# Altium project DCSource.PrjPcb
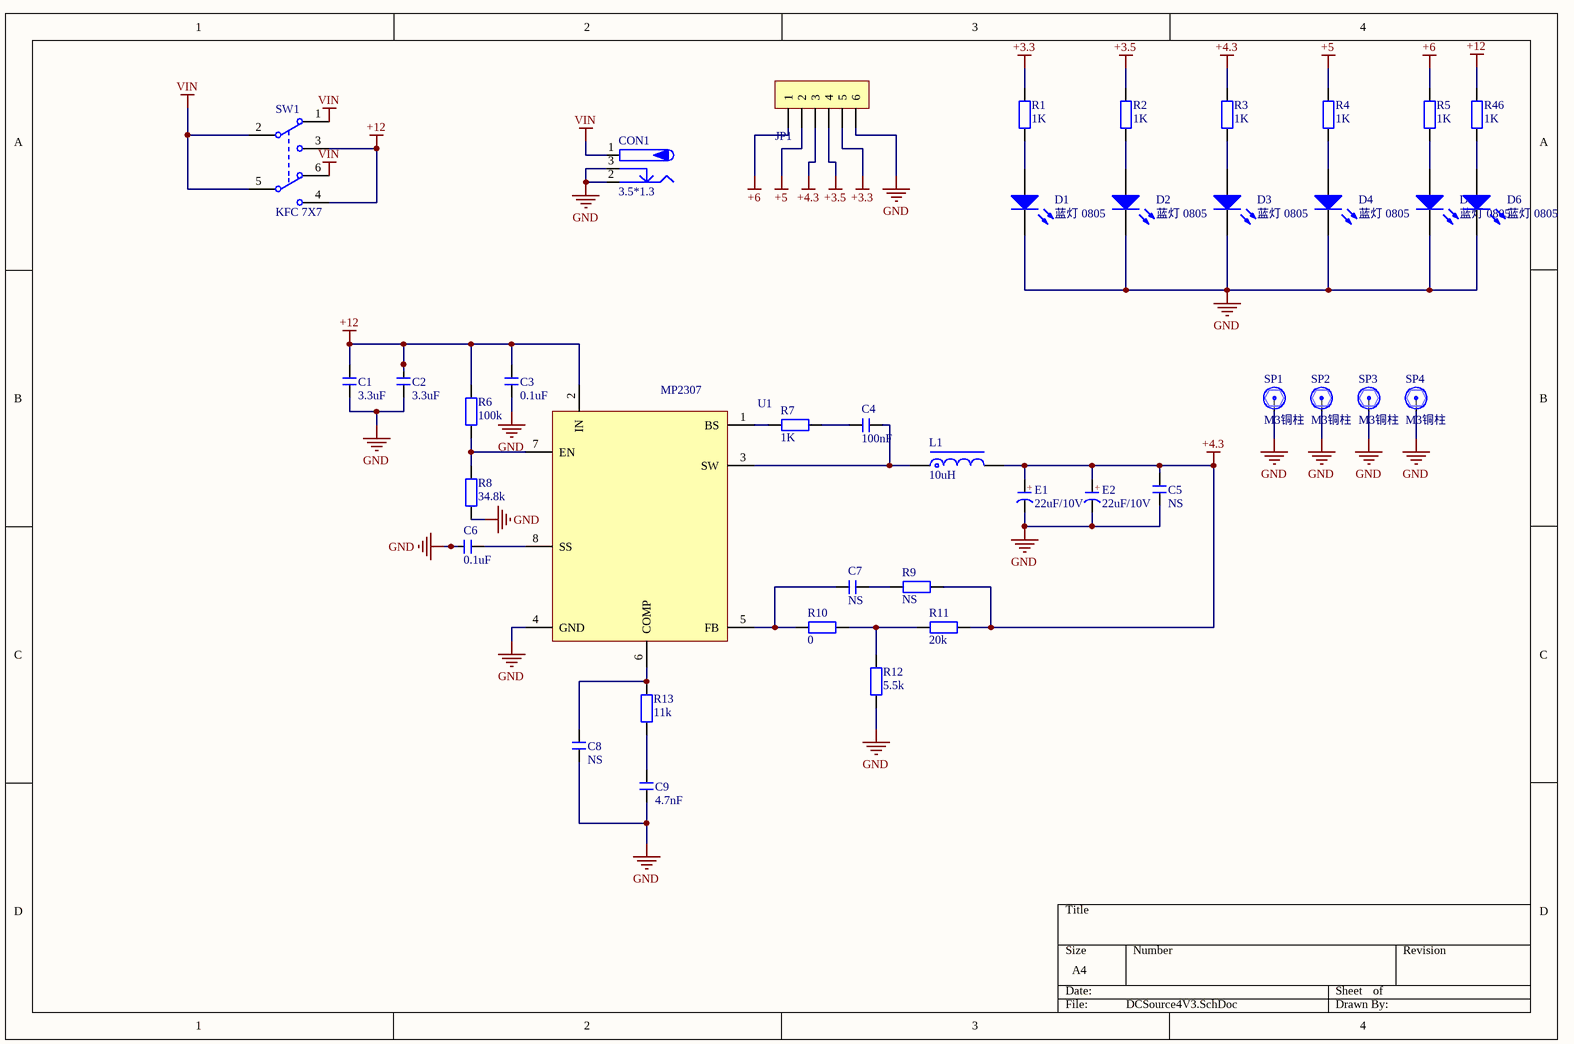
[diagram p0: DCSource4V3.SchDoc]
4 sheets, 103 parts. Net scope: global (net labels, ports and power ports of the same name join across sheets).
Board file: DCSource.PcbDoc
Sheets:
  DCSource4V3.SchDoc
  DCSource3V3.SchDoc
  DCSource3V5.SchDoc
  DCSource5V0.SchDoc

## Sheet DCSource4V3.SchDoc
size A4; DocumentNumber: 1; SheetNumber: 1; SheetTotal: 5

### Parts
C1  3.3uF  [C 0805_L]
C2  3.3uF  [C 0805_L]
C3  0.1uF  [C 0805_L]
C4  100nF  [C 0805_L]
C5  NS  [C 0805_L]
C6  0.1uF  [C 0805_L]
C7  NS  [C 0805_L]
C8  NS  [C 0805_L]
C9  4.7nF  [C 0805_L]
CON1  3.5*1.3  [DC-005]
D1  蓝灯 0805  [0805_LED_S1]
D2  蓝灯 0805  [0805_LED_S1]
D3  蓝灯 0805  [0805_LED_S1]
D4  蓝灯 0805  [0805_LED_S1]
D5  蓝灯 0805  [0805_LED_S1]
D6  蓝灯 0805  [0805_LED_S1]
E1  22uF/10V  [CT 5*6 - C]
E2  22uF/10V  [CT 5*6 - C]
JP1  HDR-1X6  [XH2.54-WS-6P]  (value not drawn)
L1  10uH  [CD31]
R1  1K  [R 0805_L]
R2  1K  [R 0805_L]
R3  1K  [R 0805_L]
R4  1K  [R 0805_L]
R5  1K  [R 0805_L]
R6  100k  [R 0805_L]
R7  1K  [R 0805_L]
R8  34.8k  [R 0805_L]
R9  NS  [R 0805_L]
R10  0  [R 0805_L]
R11  20k  [R 0805_L]
R12  5.5k  [R 0805_L]
R13  11k  [R 0805_L]
R46  1K  [R 0805_L]
SP1  M3铜柱  [M3x4_L]
SP2  M3铜柱  [M3x4_L]
SP3  M3铜柱  [M3x4_L]
SP4  M3铜柱  [M3x4_L]
SW1  KFC 7X7  [KFC DIP-7X7]
U1  MP2307  [SOP8_M]

### Nets
+3.3: JP1.5 R1.2
+3.5: JP1.4 R2.2
+4.3: C5.2 E1.1(A) E2.1(A) JP1.3 L1.2 R3.2 R9.1 R11.2
+5: JP1.2 R4.2
+6: JP1.1 R5.2
+12: C1.2 C2.2 C3.2 R6.2 R46.2 SW1.3(NO1) SW1.4(NO2) U1.2(IN)
GND: C1.1 C2.1 C3.1 C5.1 C6.2 C8.1 C9.1 CON1.2 CON1.3 D1.K D2.K D3.K D4.K D5.K D6.K E1.2(K) E2.2(K) JP1.6 R8.1 R12.1 SP1.1 SP2.1 SP3.1 SP4.1 U1.4(GND)
VIN: CON1.1 SW1.1(NC1) SW1.2(COM2) SW1.5(COM2) SW1.6(NC2)
NetC4_1: C4.1 R7.2
NetC4_2: C4.2 L1.1 U1.3(SW)
NetC6_1: C6.1 U1.8(SS)
NetC7_1: C7.1 R10.1 U1.5(FB)
NetC7_2: C7.2 R9.2
NetC8_2: C8.2 R13.2 U1.6(COMP)
NetC9_2: C9.2 R13.1
NetD1_A: D1.A R1.1
NetD2_A: D2.A R2.1
NetD3_A: D3.A R3.1
NetD4_A: D4.A R4.1
NetD5_A: D5.A R5.1
NetD6_A: D6.A R46.1
NetR6_1: R6.1 R8.2 U1.7(EN)
NetR7_1: R7.1 U1.1(BS)
NetR10_2: R10.2 R11.1 R12.2

### Notes on the sheet
- (in symbol C-CT) +

### Library data of the parts
C1-C9 = C: 无极性贴片电容; 材质: X7R; BOM名称: 无极性贴片电容
CON1 = P-DC: 低压电源接口; BOM名称: DC电源接口
D1-D6 = 0805 蓝灯: 发光二极管; ComponentLink1Description: 供应商链接; ComponentLink1URL: http://www.szlcsc.com/product/details_2666.html; Package: 0805; Supplier: LC; SuppliersPartNumber: C2293
E1 E2 = C-CT: 贴片固态电容; BOM名称: 贴片固态电容
JP1 = Header 6: 6P接插件; BOM名称: 6P接插件
L1 = L-CD: 贴片功率电感; BOM名称: 功率电感
R1-R13 R46 = R: 贴片电阻; BOM名称: 贴片电阻
SP1-SP4 = 铜柱小焊盘: 铜柱; BOM名称: 铜柱
SW1 = KFC 7X7: 7*7自锁开关; BOM名称: 7*7自锁开关
U1 = Component_1

## Sheet DCSource3V3.SchDoc
size A4; DocumentNumber: 2; SheetNumber: 2; SheetTotal: 5
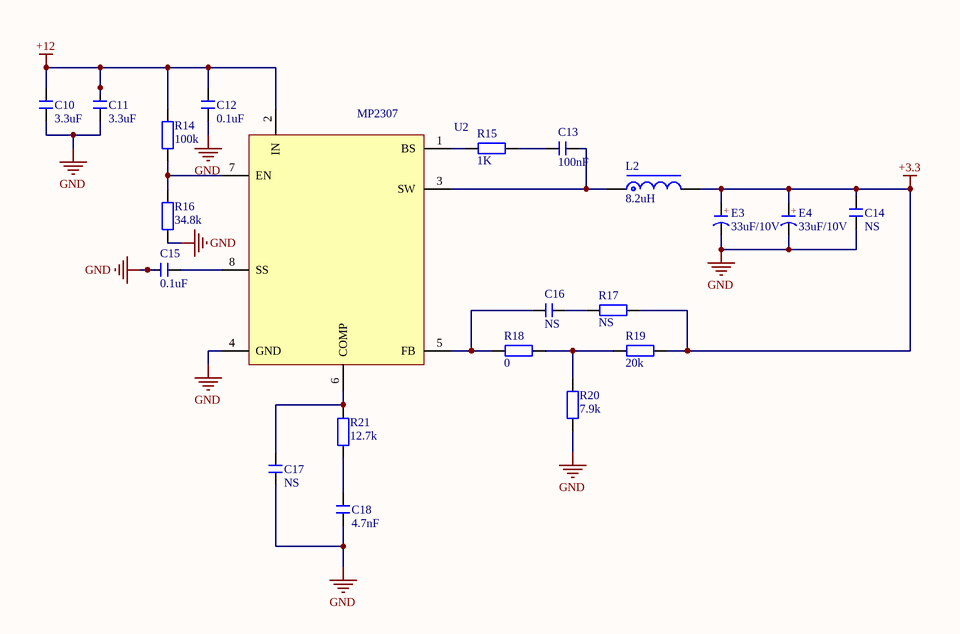
[diagram p1: DCSource3V3.SchDoc]

### Parts
C10  3.3uF  [C 0805_L]
C11  3.3uF  [C 0805_L]
C12  0.1uF  [C 0805_L]
C13  100nF  [C 0805_L]
C14  NS  [C 0805_L]
C15  0.1uF  [C 0805_L]
C16  NS  [C 0805_L]
C17  NS  [C 0805_L]
C18  4.7nF  [C 0805_L]
E3  33uF/10V  [CT 5*6 - C]
E4  33uF/10V  [CT 5*6 - C]
L2  8.2uH  [CD31]
R14  100k  [R 0805_L]
R15  1K  [R 0805_L]
R16  34.8k  [R 0805_L]
R17  NS  [R 0805_L]
R18  0  [R 0805_L]
R19  20k  [R 0805_L]
R20  7.9k  [R 0805_L]
R21  12.7k  [R 0805_L]
U2  MP2307  [SOP8_M]

### Nets
+3.3: C14.2 E3.1(A) E4.1(A) L2.2 R17.1 R19.2
+12: C10.2 C11.2 C12.2 R14.2 U2.2(IN)
GND: C10.1 C11.1 C12.1 C14.1 C15.2 C17.1 C18.1 E3.2(K) E4.2(K) R16.1 R20.1 U2.4(GND)
NetC13_1: C13.1 R15.2
NetC13_2: C13.2 L2.1 U2.3(SW)
NetC15_1: C15.1 U2.8(SS)
NetC16_1: C16.1 R18.1 U2.5(FB)
NetC16_2: C16.2 R17.2
NetC17_2: C17.2 R21.2 U2.6(COMP)
NetC18_2: C18.2 R21.1
NetR14_1: R14.1 R16.2 U2.7(EN)
NetR15_1: R15.1 U2.1(BS)
NetR18_2: R18.2 R19.1 R20.2

### Notes on the sheet
- (in symbol C-CT) +

### Library data of the parts
C10-C18 = C: 无极性贴片电容; 材质: X7R; BOM名称: 无极性贴片电容
E3 E4 = C-CT: 贴片固态电容; BOM名称: 贴片固态电容
L2 = L-CD: 贴片功率电感; BOM名称: 功率电感
R14-R21 = R: 贴片电阻; BOM名称: 贴片电阻
U2 = Component_1

## Sheet DCSource3V5.SchDoc
size A4; DocumentNumber: 3; SheetNumber: 3; SheetTotal: 5
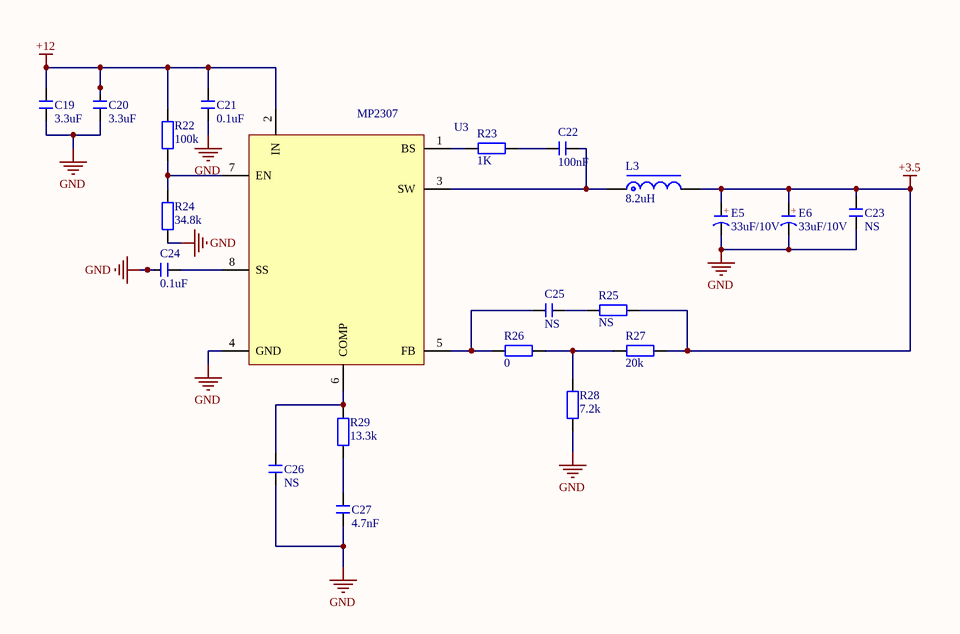
[diagram p2: DCSource3V5.SchDoc]

### Parts
C19  3.3uF  [C 0805_L]
C20  3.3uF  [C 0805_L]
C21  0.1uF  [C 0805_L]
C22  100nF  [C 0805_L]
C23  NS  [C 0805_L]
C24  0.1uF  [C 0805_L]
C25  NS  [C 0805_L]
C26  NS  [C 0805_L]
C27  4.7nF  [C 0805_L]
E5  33uF/10V  [CT 5*6 - C]
E6  33uF/10V  [CT 5*6 - C]
L3  8.2uH  [CD31]
R22  100k  [R 0805_L]
R23  1K  [R 0805_L]
R24  34.8k  [R 0805_L]
R25  NS  [R 0805_L]
R26  0  [R 0805_L]
R27  20k  [R 0805_L]
R28  7.2k  [R 0805_L]
R29  13.3k  [R 0805_L]
U3  MP2307  [SOP8_M]

### Nets
+3.5: C23.2 E5.1(A) E6.1(A) L3.2 R25.1 R27.2
+12: C19.2 C20.2 C21.2 R22.2 U3.2(IN)
GND: C19.1 C20.1 C21.1 C23.1 C24.2 C26.1 C27.1 E5.2(K) E6.2(K) R24.1 R28.1 U3.4(GND)
NetC22_1: C22.1 R23.2
NetC22_2: C22.2 L3.1 U3.3(SW)
NetC24_1: C24.1 U3.8(SS)
NetC25_1: C25.1 R26.1 U3.5(FB)
NetC25_2: C25.2 R25.2
NetC26_2: C26.2 R29.2 U3.6(COMP)
NetC27_2: C27.2 R29.1
NetR22_1: R22.1 R24.2 U3.7(EN)
NetR23_1: R23.1 U3.1(BS)
NetR26_2: R26.2 R27.1 R28.2

### Notes on the sheet
- (in symbol C-CT) +

### Library data of the parts
C19-C27 = C: 无极性贴片电容; 材质: X7R; BOM名称: 无极性贴片电容
E5 E6 = C-CT: 贴片固态电容; BOM名称: 贴片固态电容
L3 = L-CD: 贴片功率电感; BOM名称: 功率电感
R22-R29 = R: 贴片电阻; BOM名称: 贴片电阻
U3 = Component_1

## Sheet DCSource5V0.SchDoc
size A4; DocumentNumber: 5; SheetNumber: 5; SheetTotal: 5
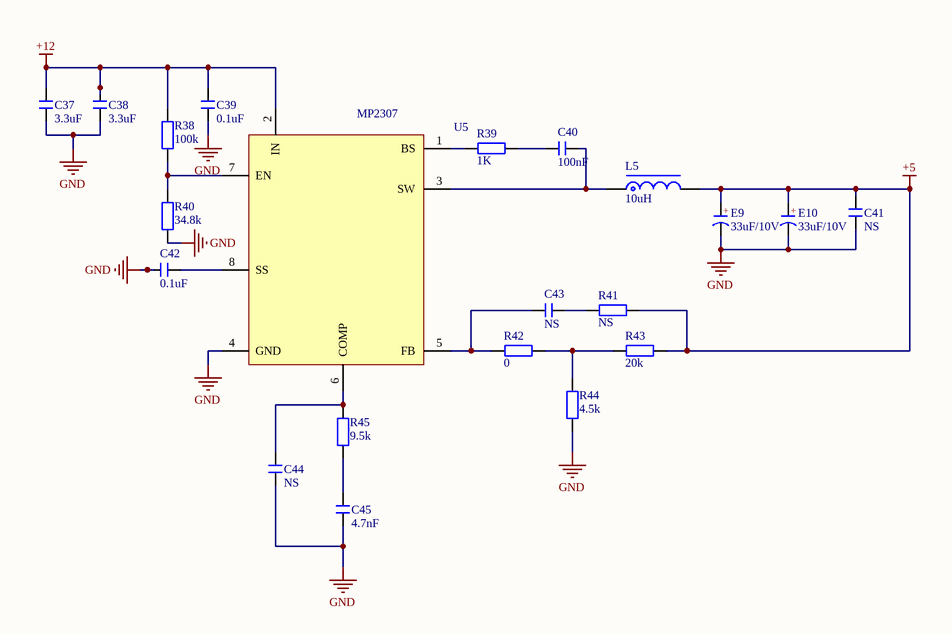
[diagram p3: DCSource5V0.SchDoc]

### Parts
C37  3.3uF  [C 0805_L]
C38  3.3uF  [C 0805_L]
C39  0.1uF  [C 0805_L]
C40  100nF  [C 0805_L]
C41  NS  [C 0805_L]
C42  0.1uF  [C 0805_L]
C43  NS  [C 0805_L]
C44  NS  [C 0805_L]
C45  4.7nF  [C 0805_L]
E9  33uF/10V  [CT 5*6 - C]
E10  33uF/10V  [CT 5*6 - C]
L5  10uH  [CD31]
R38  100k  [R 0805_L]
R39  1K  [R 0805_L]
R40  34.8k  [R 0805_L]
R41  NS  [R 0805_L]
R42  0  [R 0805_L]
R43  20k  [R 0805_L]
R44  4.5k  [R 0805_L]
R45  9.5k  [R 0805_L]
U5  MP2307  [SOP8_M]

### Nets
+5: C41.2 E9.1(A) E10.1(A) L5.2 R41.1 R43.2
+12: C37.2 C38.2 C39.2 R38.2 U5.2(IN)
GND: C37.1 C38.1 C39.1 C41.1 C42.2 C44.1 C45.1 E9.2(K) E10.2(K) R40.1 R44.1 U5.4(GND)
NetC40_1: C40.1 R39.2
NetC40_2: C40.2 L5.1 U5.3(SW)
NetC42_1: C42.1 U5.8(SS)
NetC43_1: C43.1 R42.1 U5.5(FB)
NetC43_2: C43.2 R41.2
NetC44_2: C44.2 R45.2 U5.6(COMP)
NetC45_2: C45.2 R45.1
NetR38_1: R38.1 R40.2 U5.7(EN)
NetR39_1: R39.1 U5.1(BS)
NetR42_2: R42.2 R43.1 R44.2

### Notes on the sheet
- (in symbol C-CT) +

### Library data of the parts
C37-C45 = C: 无极性贴片电容; 材质: X7R; BOM名称: 无极性贴片电容
E9 E10 = C-CT: 贴片固态电容; BOM名称: 贴片固态电容
L5 = L-CD: 贴片功率电感; BOM名称: 功率电感
R38-R45 = R: 贴片电阻; BOM名称: 贴片电阻
U5 = Component_1

## Nets that join several sheets
+3.3: DCSource4V3 (JP1.5 R1.2), DCSource3V3 (6 pins)
+3.5: DCSource4V3 (JP1.4 R2.2), DCSource3V5 (6 pins)
+5: DCSource4V3 (JP1.2 R4.2), DCSource5V0 (6 pins)
+12: DCSource4V3 (8 pins), DCSource3V3 (5 pins), DCSource3V5 (5 pins), DCSource5V0 (5 pins)
GND: DCSource4V3 (25 pins), DCSource3V3 (12 pins), DCSource3V5 (12 pins), DCSource5V0 (12 pins)